# EasyEDA schematic SCH_GSME_voltmeter_Arduino_ESP8266_TP4056_2023-03-12.json
TITLE: Watch-i-metro; REV: 1.1; Date: 2023-03-12; Sheet: 1/1; Drawn By: Rubén Mellado C.; Company: Colegio Juan Comenius
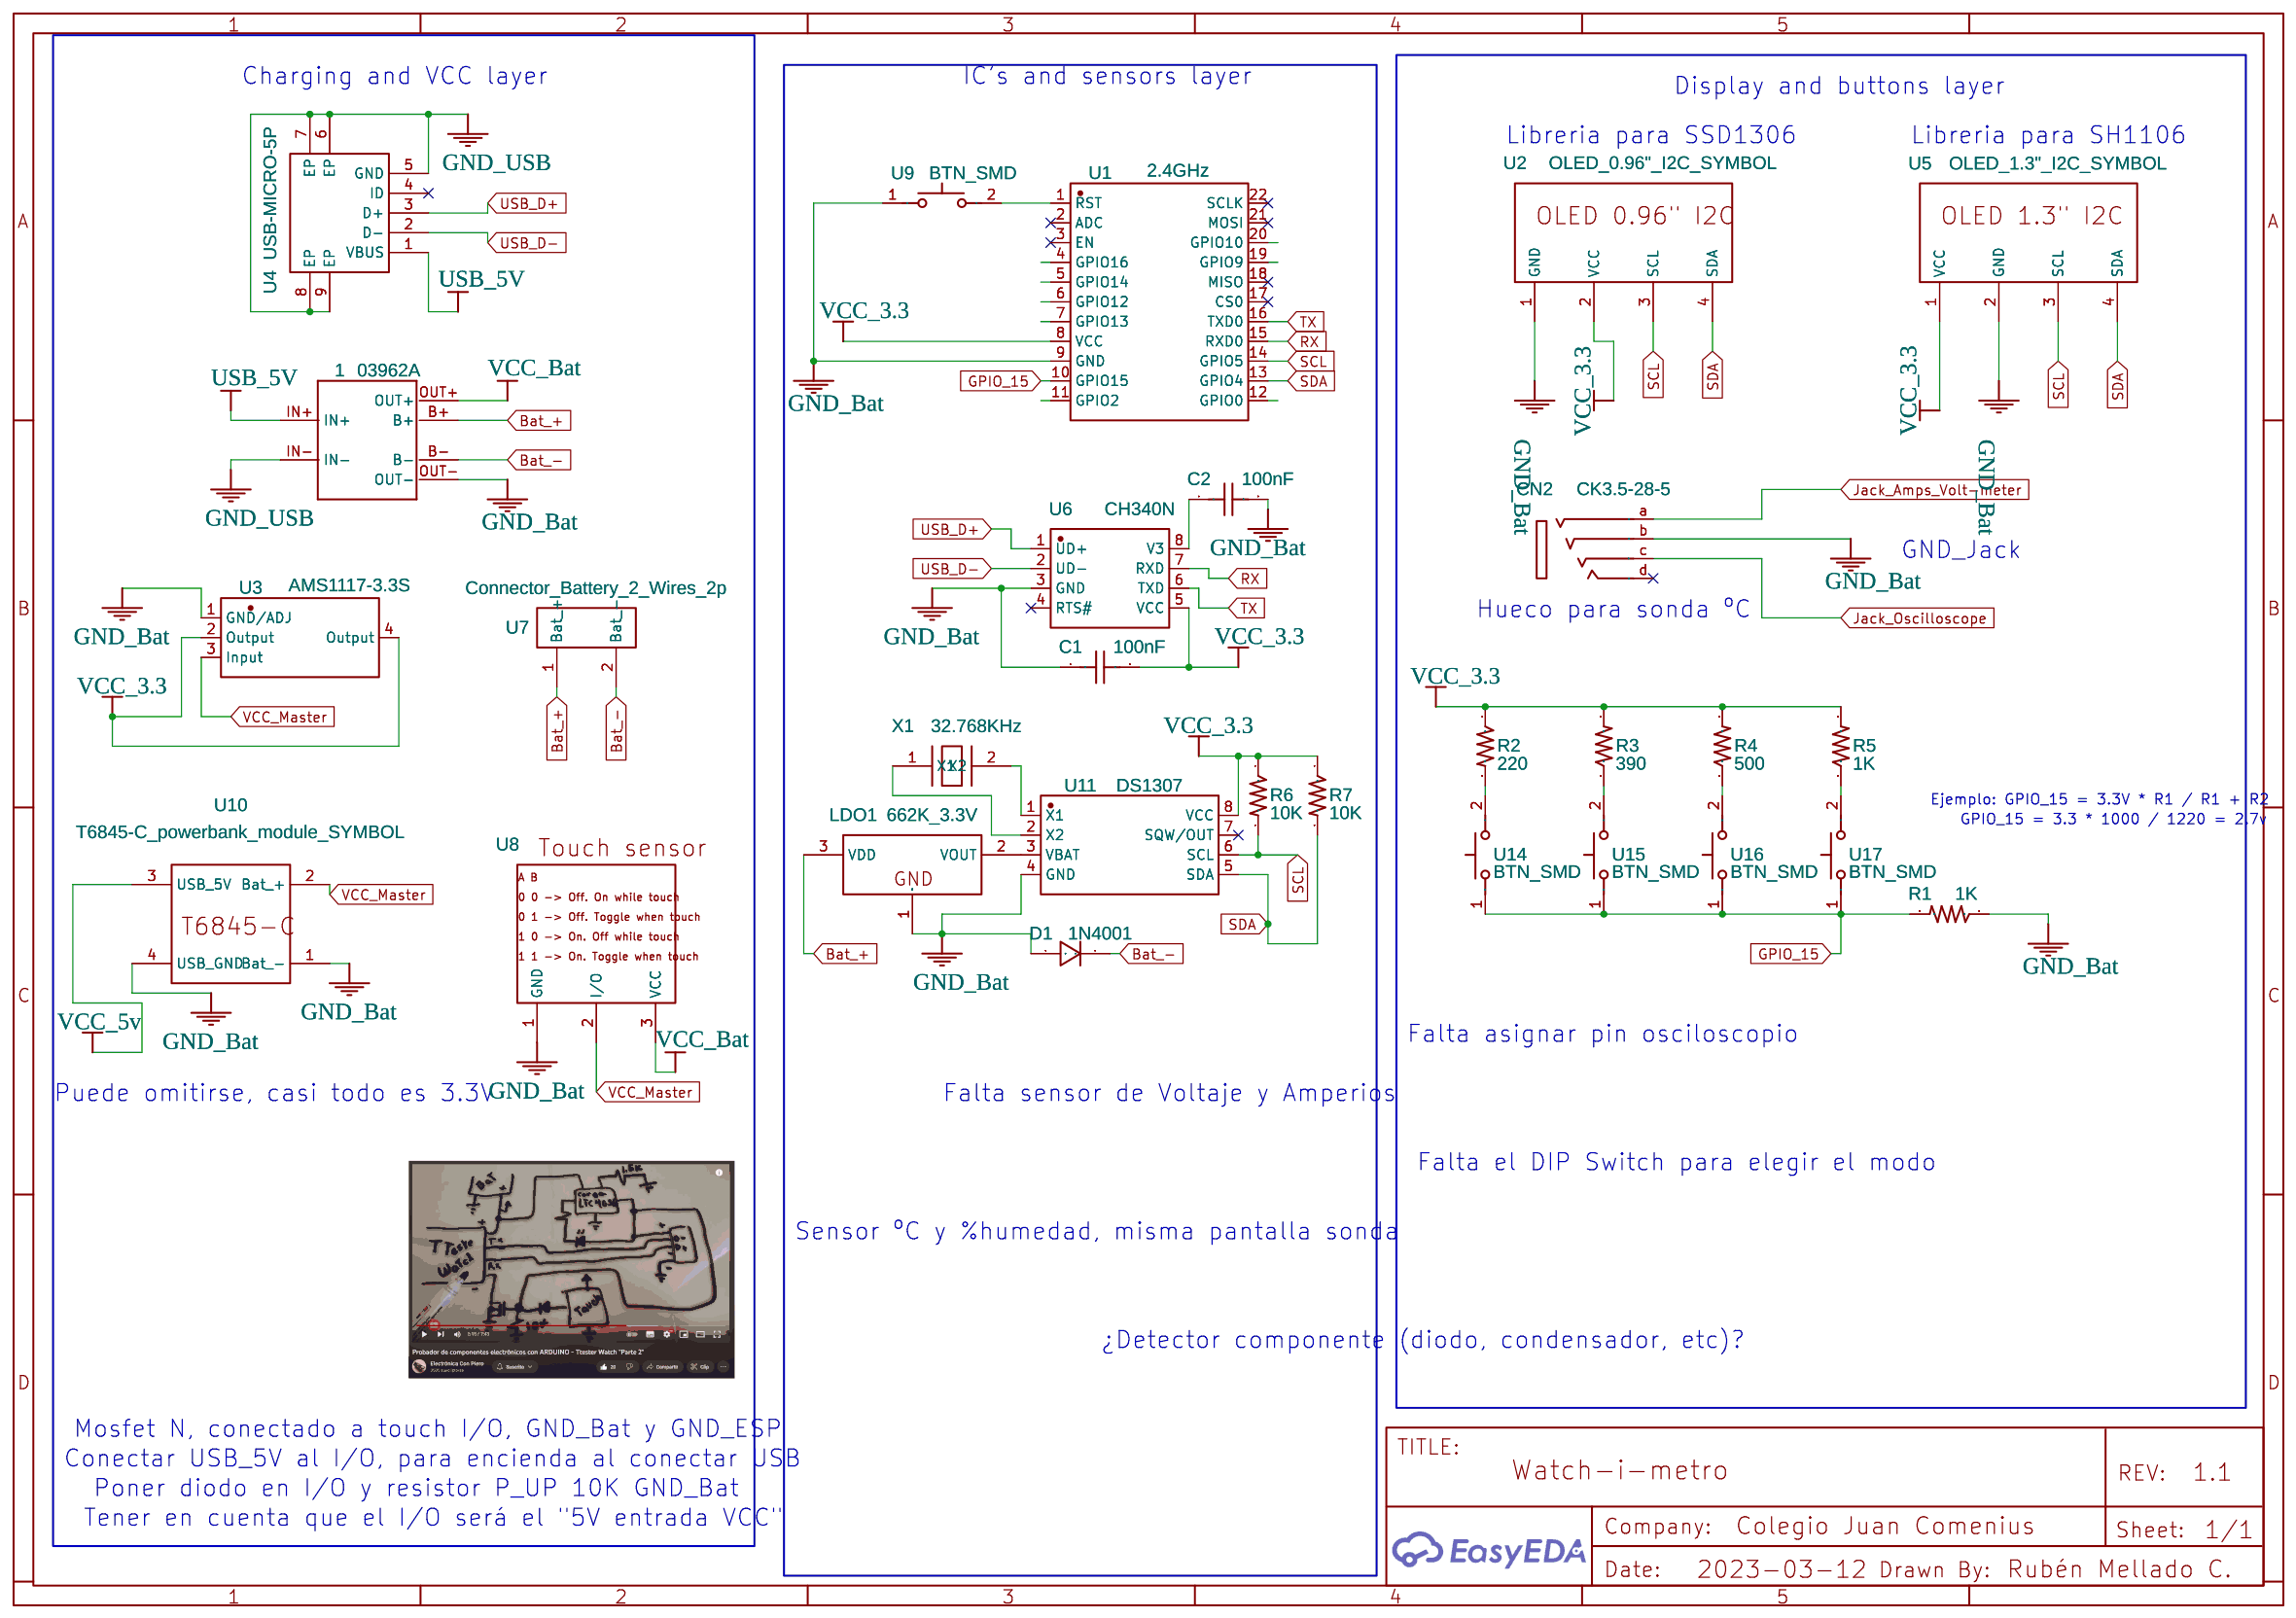
[diagram p0: schematic sheet]

## Parts
1  03962A  [03962A_THT_TP4056_FOOTPRINT]
C1  100nF  [C0603]
C2  100nF  [C0603]
CN2  CK3.5-28-5  [AUDIO-TH_CK3.5-28-5]
D1  1N4001  [SMA_L4.3-W2.5-LS5.0-RD]
LDO1  662K_3.3V  [SOT-23-3_L2.9-W1.3-P1.90-LS2.4-BR]
R1  1K  [0603-RES]
R2  220  [0603-RES]
R3  390  [0603-RES]
R4  500  [0603-RES]
R5  1K  [0603-RES]
R6  10K  [0603-RES]
R7  10K  [0603-RES]
U1  2.4GHz  [WIFIM-SMD_ESP-12F-ESP8266MOD]
U2  OLED_0.96"_I2C_SYMBOL  [OLED_0.96"_I2C_FOOTPRINT]
U3  AMS1117-3.3S  [SOT-223-4_L6.5-W3.5-P2.30-LS7.0-BL]
U4  USB-MICRO-5P  [MICRO-USB-SMD_MICRO-USB-A9]
U5  OLED_1.3"_I2C_SYMBOL  [OLED_1.3"_I2C_FOOTPRINT]
U6  CH340N  [SOP-8_L5.0-W4.0-P1.27-LS6.0-BL]
U7  Connector_Battery_2_Wires_2p  [CONNECTOR_BATTERY_2_WIRES_2P_FOOTPRINT]
U8  Touch_Sensor  [TOUCH_SENSOR_3P_A_B_FOOTPRINT]
U9  BTN_SMD  [SW-SMD_L6.0-W3.5-LS8.0-1]
U10  T6845-C_powerbank_module_SYMBOL  [T6845-C_POWERBANK_MODULE_FOOTPRINT]
U11  DS1307  [SOP-8_L4.9-W3.9-P1.27-LS6.0-BL]
U14  BTN_SMD  [SW-SMD_L6.0-W3.5-LS8.0-1]
U15  BTN_SMD  [SW-SMD_L6.0-W3.5-LS8.0-1]
U16  BTN_SMD  [SW-SMD_L6.0-W3.5-LS8.0-1]
U17  BTN_SMD  [SW-SMD_L6.0-W3.5-LS8.0-1]
X1  32.768KHz  [QUARTZ_X_2P_FOOTPRINT]

## Library data of the parts
1 = 03962A: Contributor: Anselmo Busnadiego; Package Display: No
C1 C2 = C_0603_US: Contributor: LCEDA_Lib
CN2 = CK3.5-28-5: Supplier: LCSC; Supplier Part: C718048; Manufacturer: JINJIA; Contributor: LCSC; JLCPCB Part Class: Extended Part
D1 = 1N4001-SS34: Supplier: LCSC; Supplier Part: C9900003229; Manufacturer: null; JLCPCB Part Class: Extended Part; Contributor: LCSC
LDO1 = SC662K-3.3V: Supplier: LCSC; Manufacturer: FM(富满); Supplier Part: C83932; JLCPCB Part Class: Extended Part
R1-R7 = RESISTOR0603: Resistor; Contributor: SparkFun
U1 = ESP-12F(ESP8266MOD): Supplier: LCSC; Manufacturer: Ai-Thinker(安信可); Supplier Part: C82891; JLCPCB Part Class: Extended Part
U2 = OLED_0.96"_I2C_SYMBOL: Contributor: Teycot YT; Package Display: No
U3 = AMS1117-3.3S: Supplier: LCSC; Supplier Part: C2842296; Manufacturer: KEXIN(科信); link: https://atta.szlcsc.com//upload/public/pdf/source/20220119/687E7B65F4F54F278E2F75AE3BEEDBF9.pdf; Contributor: LCSC; JLCPCB Part Class: Extended Part
U4 = USB-MICRO-5P: Supplier: LCSC; Supplier Part: C9900014288; Manufacturer: null; Manufacturer Part: USB-Micro-5P; Contributor: lcsc; JLCPCB Part Class: Extended Part
U5 = OLED_1.3"_I2C_SYMBOL: Contributor: teycotyt; Package Display: No
U6 = CH340N: Supplier: LCSC; Supplier Part: C506813; Manufacturer: WCH(南京沁恒); Contributor: LCSC; JLCPCB Part Class: Extended Part
U7 = Connector_Battery_2_Wires_2p: Contributor: Teycot YT; Package Display: No
U8 = Touch_Sensor_3p_A_B_SYMBOL: Contributor: Teycot YT; Package Display: No
U9 U14-U17 = BUTTON2: Supplier: LCSC; Supplier Part: C9900005988; Manufacturer: null; JLCPCB Part Class: Extended Part; Contributor: LCSC
U10 = T6845-C_powerbank_module_SYMBOL: Contributor: Teycot YT
U11 = DS1307M/TR: Supplier: LCSC; Supplier Part: C356706; Manufacturer: HGSEMI(华冠); Contributor: LCSC; JLCPCB Part Class: Extended Part
X1 = Quartz_X_2p_Symbol: Contributor: Teycot YT; Package Display: No

## Nets
GND_Bat: 1.OUT- C1.1 C2.2 CN2.b D1.2 LDO1.1(GND) R1.1 U1.9(GND) U2.1(GND) U3.1(GND/ADJ) U5.2(GND) U6.3(GND) U8.1(GND) U9.1 U10.1(Bat_-) U10.4(USB_GND) U11.4(GND)
GND_USB: 1.IN- U4.5(GND) U4.6(EP) U4.7(EP) U4.8(EP) U4.9(EP)
VCC_3.3: C1.2 R2.1 R3.2 R4.2 R5.2 R6.1 R7.1 U1.8(VCC) U2.2(VCC) U3.2(Output) U3.4(Output) U5.1(VCC) U6.5(VCC) U11.8(VCC)
VCC_5v: U10.3(USB_5V)
VCC_Bat: 1.OUT+ U8.3(VCC)
VCC_Master: U3.3(Input) U8.2(I/O) U10.2(Bat_+)
Bat_+: 1.B+ LDO1.3(VDD) U7.1(Bat_+)
Bat_-: 1.B- D1.1 U7.2(Bat_-)
GPIO_15: R1.2 U1.10(GPIO15) U14.1 U15.1 U16.1 U17.1
Jack_Amps_Volt-meter: CN2.a
Jack_Oscilloscope: CN2.c
RX: U1.15(RXD0) U6.7(RXD)
SCL: R6.2 U1.14(GPIO5) U2.3(SCL) U5.3(SCL) U11.6(SCL)
SDA: R7.2 U1.13(GPIO4) U2.4(SDA) U5.4(SDA) U11.5(SDA)
TX: U1.16(TXD0) U6.6(TXD)
USB_5V: 1.IN+ U4.1(VBUS)
USB_D+: U4.3(D+) U6.1(UD+)
USB_D-: U4.2(D-) U6.2(UD-)
Net-(C2-1): C2.1 U6.8(V3)
Net-(LDO1-2): LDO1.2(VOUT) U11.3(VBAT)
Net-(R2-2): R2.2 U14.2
Net-(R3-1): R3.1 U15.2
Net-(R4-1): R4.1 U16.2
Net-(R5-1): R5.1 U17.2
Net-(U1-1): U1.1(RST) U9.2
Net-(U11-1): U11.1(X1) X1.2(X2)
Net-(U11-2): U11.2(X2) X1.1(X1)

Not connected (* = marked no-connect by the designer): CN2 d*; U1 2(ADC)* 3(EN)* 4(GPIO16) 5(GPIO14) 6(GPIO12) 7(GPIO13) 11(GPIO2) 12(GPIO0) 17(CS0)* 18(MISO)* 19(GPIO9) 20(GPIO10) 21(MOSI)* 22(SCLK)*; U4 4(ID)*; U6 4(RTS#)*; U11 7(SQW/OUT)*

## Notes on the sheet
- Charging and VCC layer
- IC's and sensors layer
- Display and buttons layer
- Libreria para SSD1306
- Libreria para SH1106
- GND_Jack
- Hueco para sonda ºC
- Ejemplo: GPIO_15 = 3.3V * R1 / R1 + R2
- GPIO_15 = 3.3 * 1000 / 1220 = 2.7v
- Falta asignar pin osciloscopio
- Puede omitirse, casi todo es 3.3V
- Falta sensor de Voltaje y Amperios
- Falta el DIP Switch para elegir el modo
- Sensor ºC y %humedad, misma pantalla sonda
- ¿Detector componente (diodo, condensador, etc)?
- Mosfet N, conectado a touch I/O, GND_Bat y GND_ESP
- Conectar USB_5V al I/O, para encienda al conectar USB
- Poner diodo en I/O y resistor P_UP 10K GND_Bat
- Tener en cuenta que el I/O será el "5V entrada VCC"
